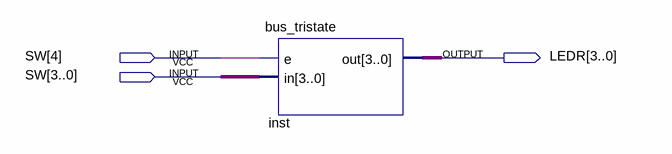
[diagram p0: schematic sheet]
// Quartus schematic bus_tristate_Teste.bdf as structural Verilog: 1 symbols, 3 pins
module bus_tristate_Teste (
  input  [4:0] SW,
  output [3:0] LEDR
);

  bus_tristate inst (.e(SW[4]), .in(SW[3:0]), .out(LEDR));
endmodule
